# Altium schematic sheet ADC.SchDoc: ADC
size 431 x 279 mm; Author: Alberto Marrone, Christian Schmitz, Leo Walter; DrawnBy: Alberto Marrone, Christian Schmitz, Leo Walter; Engineer: Alberto Marrone, Christian Schmitz, Leo Walter; Revision: V1.0; SheetNumber: 4; Project: PCB Design Final Project
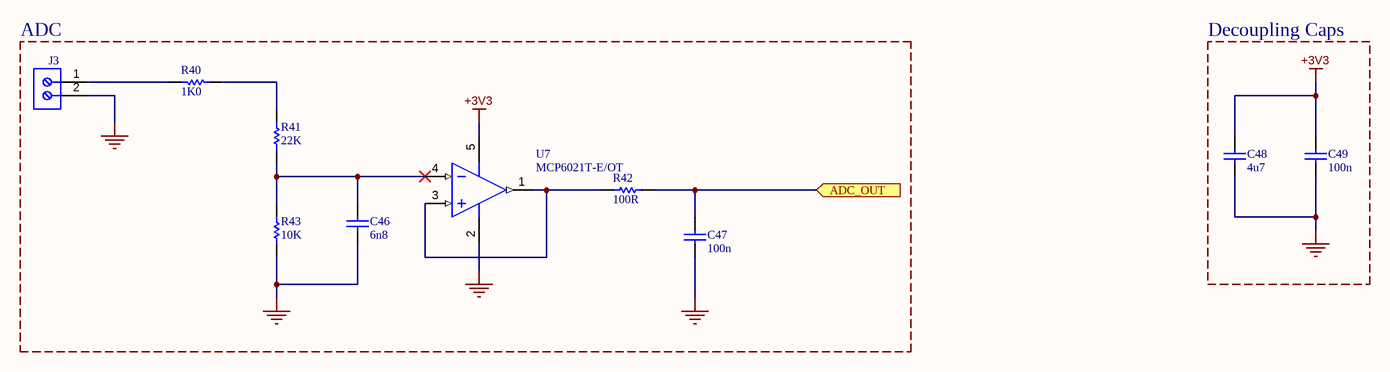
[diagram p0: ADC.SchDoc]

## Parts
C46  6n8  [0603C]
C47  100n  [0603C]
C48  4u7  [0603C]
C49  100n  [0603C]
J3  691213710002  [691213710002]  (value not drawn)
R40  1K0  [0603R]
R41  22K  [0603R]
R42  100R  [0603R]
R43  10K  [0603R]
U7  MCP6021T-E/OT  [SOT-23-OT5_N]

## Blocks framed on the sheet
ADC: C46 C47 J3 R40-R43 U7
Decoupling Caps: C48 C49

## Ports
ADC_OUT (in)

## Nets
+3V3: C48.1 C49.2 U7.5(VDD)
GND: C46.1 C47.1 C48.2 C49.1 J3.2 R43.1 U7.2(VSS)
ADC_OUT: C47.2 R42.1 ; port ADC_OUT
NetC46_2: C46.2 R41.1 R43.2 U7.4(VIN-)
NetJ3_1: J3.1 R40.1
NetR40_2: R40.2 R41.2
NetR42_2: R42.2 U7.1(VOUT) U7.3(VIN+)

## Notes on the sheet
- DWG. NO.
- REV.
- SHT.
- THIS DOCUMENT AND THE DATA DISCLOSED HEREIN OR HEREWITH IS THE PROPERTY OF ALTIUM LIMITED AND MAY BE FREELY DISTRIBUTED IN WHOLE. NO RIGHTS ARE RESERVED OR EXPRESS OR IMPLIED WARANTEE GIVEN.
- REVISION
- DESCRIPTION
- DATE
- APPROVED
- ENG:
- APPROVALS
- PROJECT
- DSN:
- CHK:
- REFERENCE DOCUMENTS
- PROJECT REVISION:
- TITLE
- DOCUMENT REVISION:
- DESIGN ITEM:
- BOM:
- FAB DWG:
- PCB DWG:
- ASSY DWG:
- SCALE:
- SIZE
- B
- CAGE CODE
- FILE NAME
- DWG NO.
- SHEET
- OF
- REV

## Library data of the parts
C46 = Capacitor_ST: Capacitor 0402 / 0603 / 0805; Voltage Rating: 50 V; Dielectric: C0G; Revision: July-2002: Re-released for DXP Platform.; Value: 6n8
C47 C49 = Cap: Capacitor; Dielectric: X7R; Published: 8-Jun-2000; Revision: July-2002: Re-released for DXP Platform.; Publisher: Altium Limited; Value: 100n
C48 = CAP SMD 0603  X5R 1µF 25V 10%: Capacitor; Rated voltage: 25V; Tolerance: 10%; Dielectric: X5R; Manufacturer: *; Manufacturer P/N: *; Order code Farnell: 1288202RL; Value: 4u7; Power: *; Temperature  Factor: *; Temperature Max: +125°C; Temperature Min: -55°C; STS Code: *
J3 = CMP-1502-02526-3: 213 Series 5MM Pitch Straight, Pcb Terminal Block, Through Hole, 2 Way; Voltage: 300V; Number of Positions Per Level: 2; Pitch: 5.0038mm; Current: 10A; Plating: Brass, Steel; Wire Gauge (Min): 16AWG; Wire Gauge (Max): 26AWG; Stripping Length: -7mm; Number of Levels: 1; RoHS: Compliant; Contact Plating: Tin; Height: 10mm; Contact Material: Brass; Width: 10.6mm; Packaging: Box; Housing Material: Nylon; Mount: Through Hole; Max Operating Temperature: 105°C; Color: Green; Lead Pitch: 5mm; Voltage Rating: 300V; Min Operating Temperature: -40°C; Current Rating: 10A; Termination: Screw; Number of Pins: 2; Number of Contacts: 2; Length: 8.3mm; Wire/Cable Gauge: 26AWG
R40 = Res1: Resistor; Published: 8-Jun-2000; Revision: July-2002: Re-released for DXP Platform.; Publisher: Altium Limited; Value: 1K0
R41-R43 = res1: Resistor; Published: 8-Jun-2000; Revision: July-2002: Re-released for DXP Platform.; Publisher: Altium Limited
  R41: Value: 22K
  R42: Value: 100R
  R43: Value: 10K
U7 = CMP-0187-00449-3: None; Nominal Supply Current: 1mA; Gain Bandwidth Product: 10MHz; Input Bias Current: 1pA; Max Supply Voltage: 5.5V; Min Input Voltage: 2.5V; Voltage Gain: 110dB; Number of Circuits: 1; Slew Rate: 7V/µs; Input Offset Voltage (Vos): 250uV; Power Supply Rejection Ratio (PSRR): 74dB; Input Offset Voltage-Max: 500uV; Output Current per Channel: 30mA; Output Current: 22mA; Common Mode Rejection Ratio: 70dB; Max Frequency: 10kHz; Amplifier Type: GENERAL PURPOSE; Contact Plating: Tin; Number of Pins: 5; Operating Supply Current: 1mA; RoHS Compliant: Yes; Mount: Surface Mount; Number of Amplifiers: 1; Case/Package: SOT-23; Min Supply Voltage: 2.5V; Radiation Hardening: No; Height: 0.051inch; Max Input Voltage: 5.5V; Min Operating Temperature: -40°C; Max Operating Temperature: 125°C; Number of Channels: 1; Package Quantity: 3000; Unity Gain Bandwidth Product: 10MHz; Length: 0.122inch; Width: 0.071inch; Number of Elements: 1; Bandwidth: 10MHz; Lead Free: Lead Free; Packaging: Tape and Reel; Technology: CMOS; Supply Current: 1mA; REACH SVHC: No SVHC